# EAGLE schematic Amplifier+Mixer (EAGLE 9.3.0)
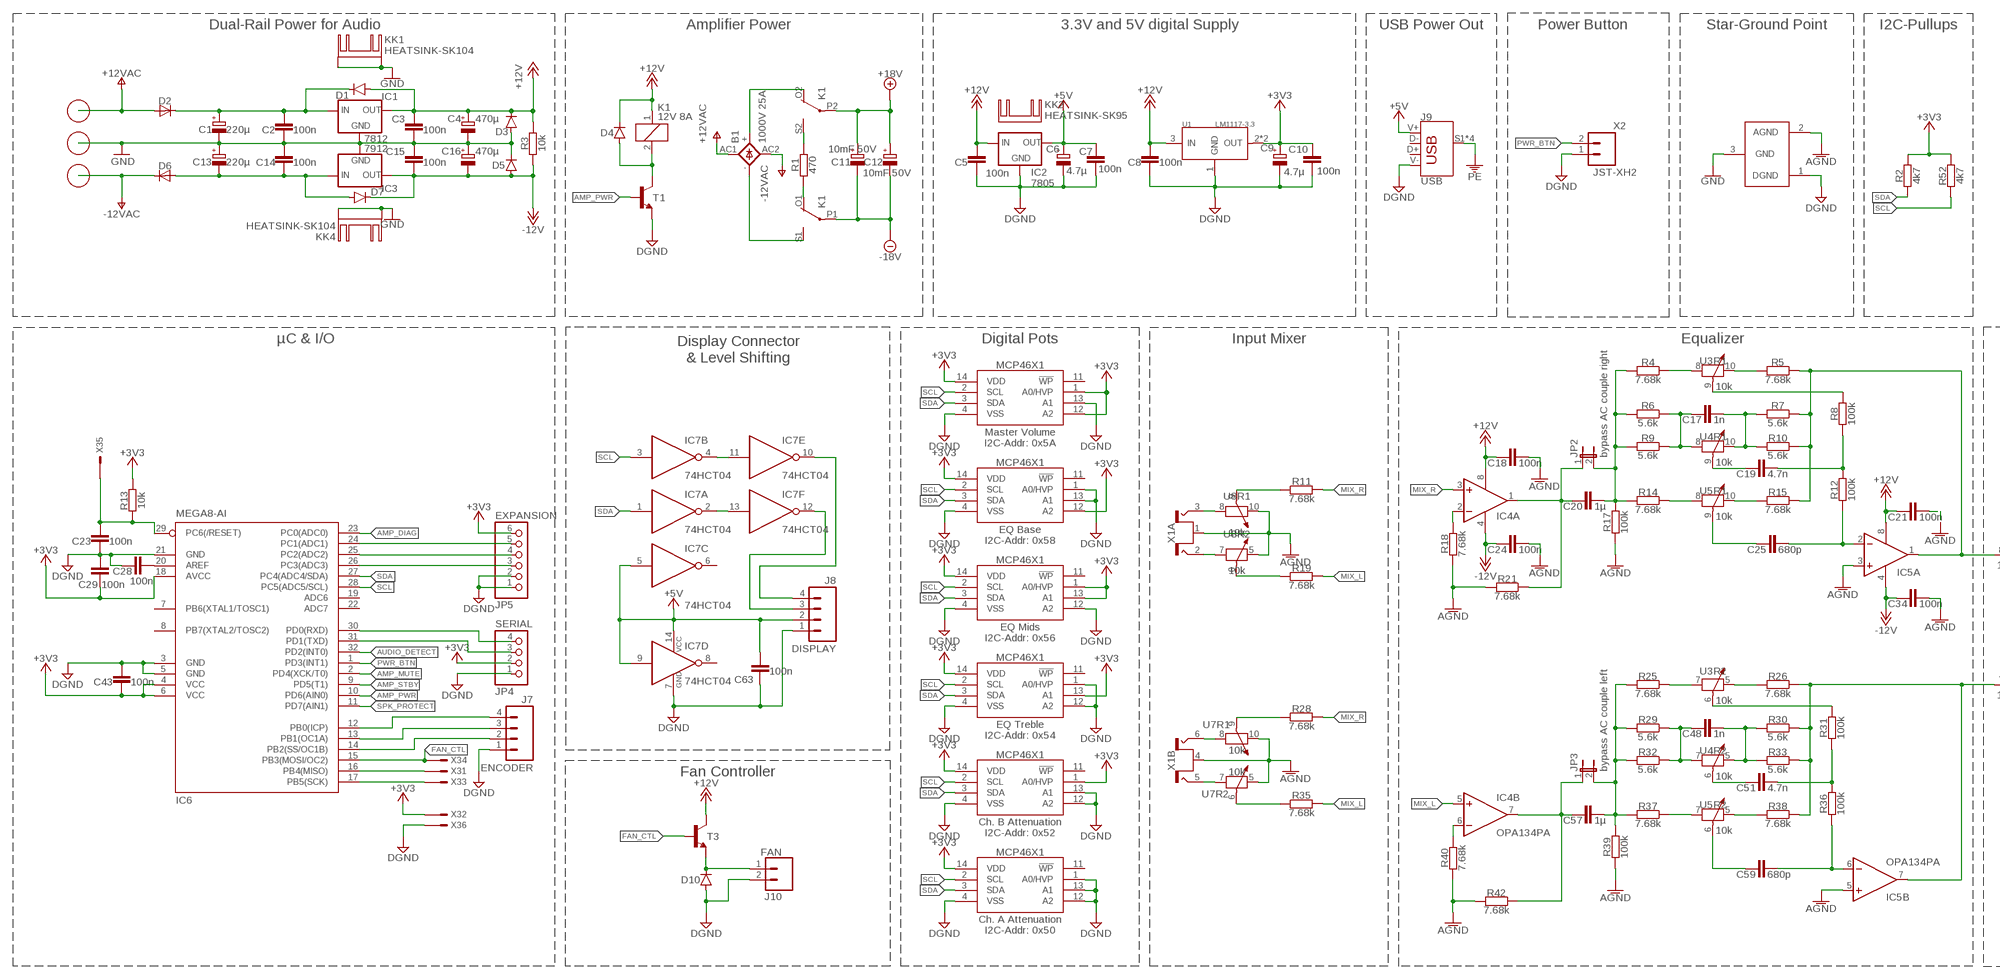
[diagram p0: schematic, sheet 1, part 1 of 2]
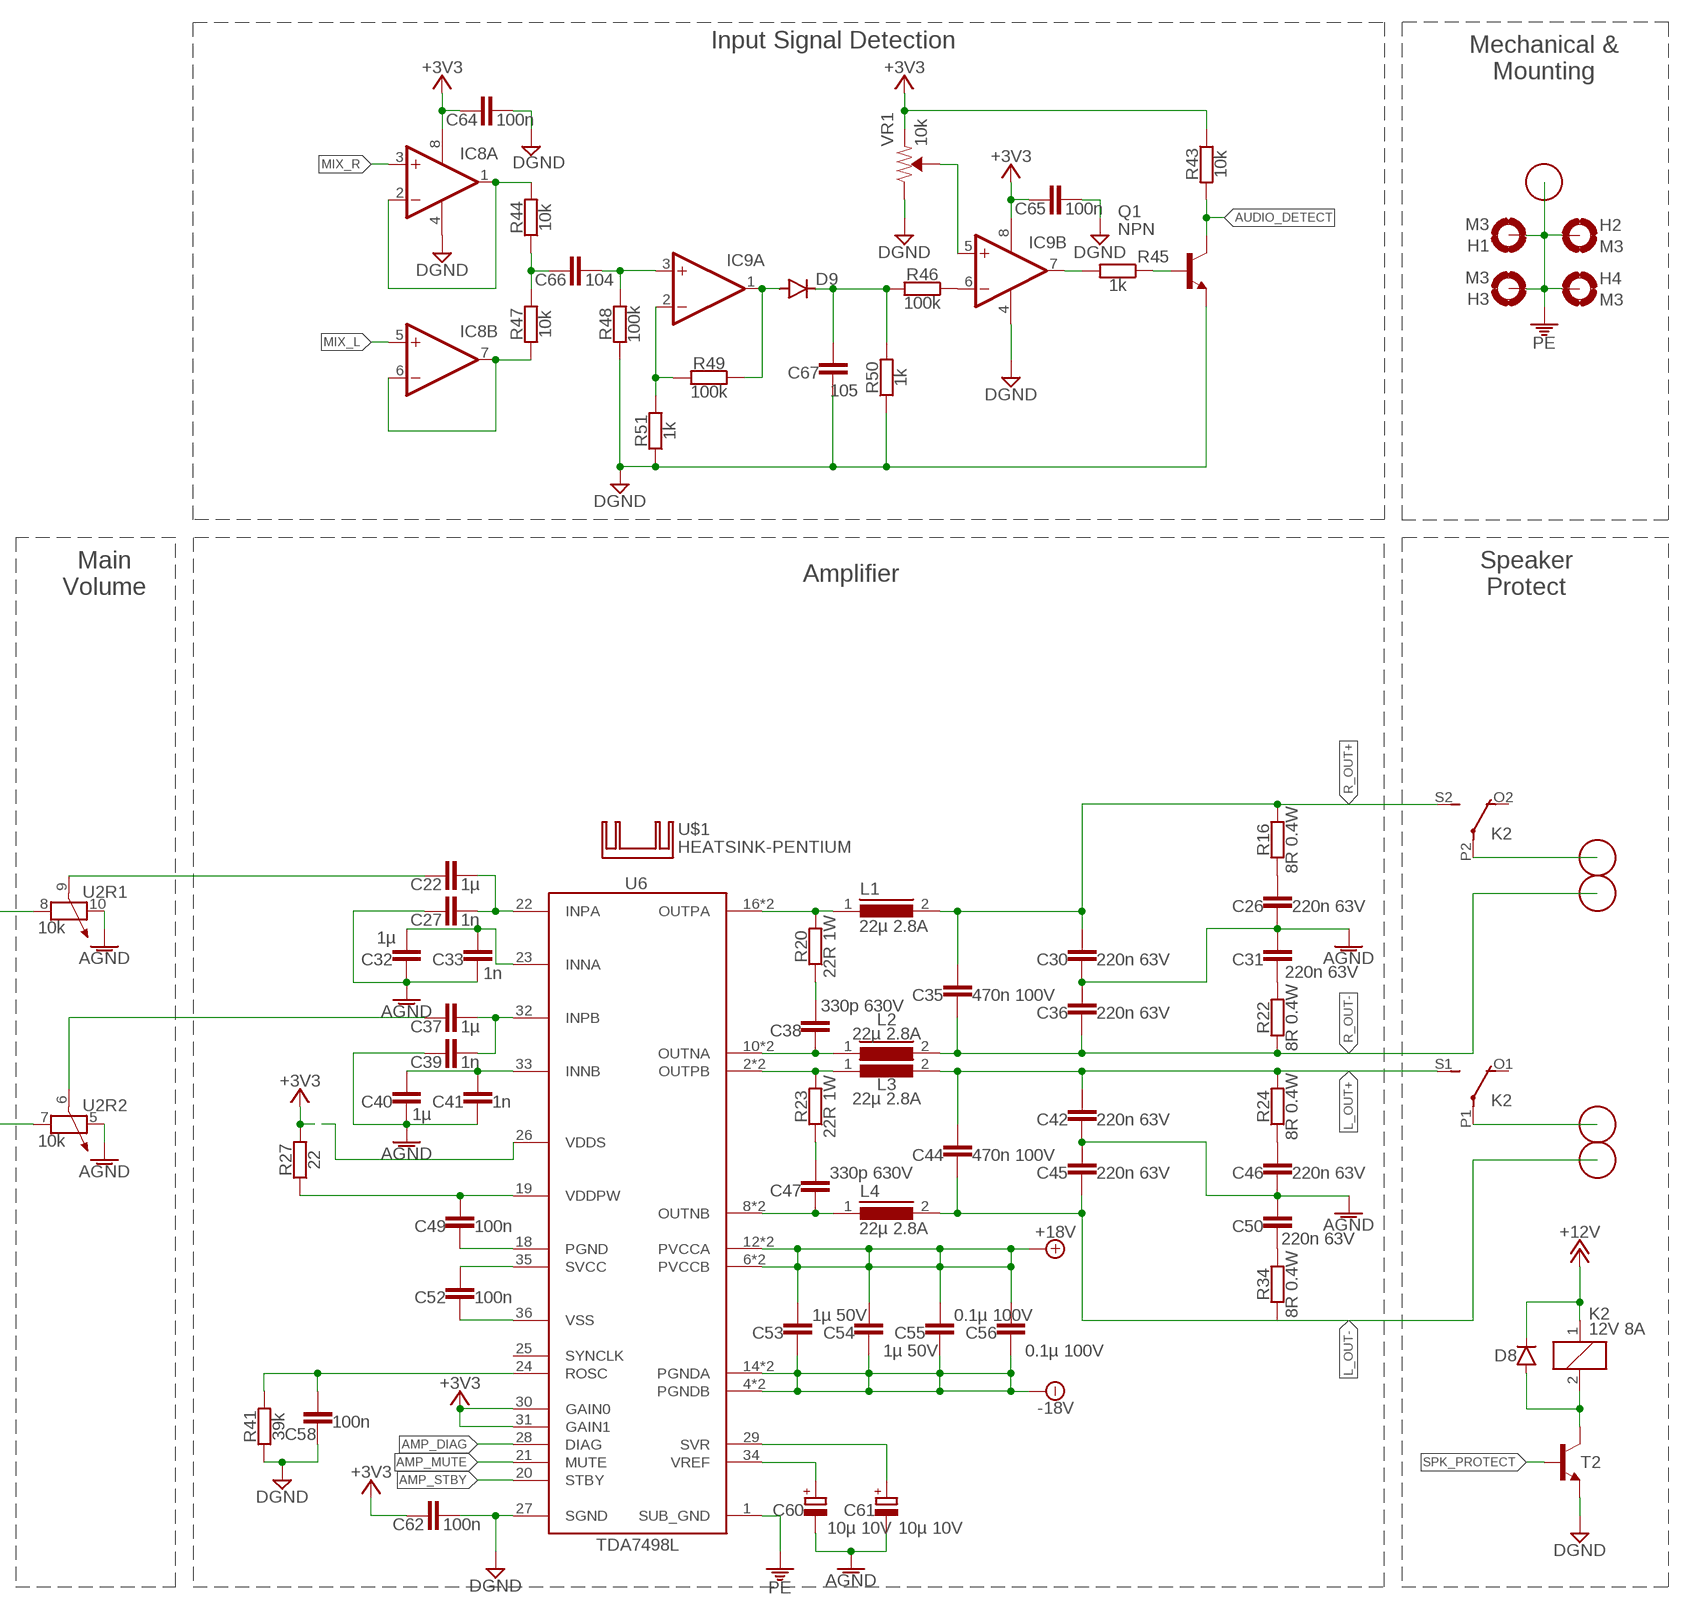
[diagram p1: schematic, sheet 1, part 2 of 2]

## Parts
B1  1000V 25A  RECTIFIER-FB100  [FB100]
C1  220µ  CPOL-EU175TMP-0810  [175TMP-0810]
C2  100n  C-EUC0603  [C0603]
C3  100n  C-EUC0603  [C0603]
C4  470µ  CPOL-EU175TMP-0810  [175TMP-0810]
C5  100n  C-EUC0603  [C0603]
C6  4.7µ  CPOL-EU153CLV-0505  [153CLV-0505]
C7  100n  C-EUC0603  [C0603]
C8  100n  C-EUC0603  [C0603]
C9  4.7µ  CPOL-EU153CLV-0505  [153CLV-0505]
C10  100n  C-EUC0603  [C0603]
C11  10mF 50V  TEAPO-SLG109M050S1A5T  [EB35D]
C12  10mF 50V  TEAPO-SLG109M050S1A5T  [EB35D]
C13  220µ  CPOL-EU175TMP-0810  [175TMP-0810]
C14  100n  C-EUC0603  [C0603]
C15  100n  C-EUC0603  [C0603]
C16  470µ  CPOL-EU175TMP-0810  [175TMP-0810]
C17  1n  C-EU050-025X075  [C050-025X075]
C18  100n  C-EUC0603  [C0603]
C19  4.7n  C-EU075-032X103  [C075-032X103]
C20  1µ  C-EU050-050X075  [C050-050X075]
C21  100n  C-EUC0603  [C0603]
C22  1µ  C-EU050-050X075  [C050-050X075]
C23  100n  C-EUC0603  [C0603]
C24  100n  C-EUC0603  [C0603]
C25  680p  C-EU050-045X075  [C050-045X075]
C26  220n 63V  C-EU050-025X075  [C050-025X075]
C27  1n  C-EU050-025X075  [C050-025X075]
C28  100n  C-EUC0603  [C0603]
C29  100n  C-EUC0603  [C0603]
C30  220n 63V  C-EU050-025X075  [C050-025X075]
C31  220n 63V  C-EU050-025X075  [C050-025X075]
C32  1µ  C-EU050-050X075  [C050-050X075]
C33  1n  C-EU050-025X075  [C050-025X075]
C34  100n  C-EUC0603  [C0603]
C35  470n 100V  C-EU050-045X075  [C050-045X075]
C36  220n 63V  C-EU050-025X075  [C050-025X075]
C37  1µ  C-EU050-050X075  [C050-050X075]
C38  330p 630V  C-EU050-045X075  [C050-045X075]
C39  1n  C-EU050-025X075  [C050-025X075]
C40  1µ  C-EU050-050X075  [C050-050X075]
C41  1n  C-EU050-025X075  [C050-025X075]
C42  220n 63V  C-EU050-025X075  [C050-025X075]
C43  100n  C-EUC0603  [C0603]
C44  470n 100V  C-EU050-045X075  [C050-045X075]
C45  220n 63V  C-EU050-025X075  [C050-025X075]
C46  220n 63V  C-EU050-025X075  [C050-025X075]
C47  330p 630V  C-EU050-045X075  [C050-045X075]
C48  1n  C-EU050-025X075  [C050-025X075]
C49  100n  C-EUC0603  [C0603]
C50  220n 63V  C-EU050-025X075  [C050-025X075]
C51  4.7n  C-EU075-032X103  [C075-032X103]
C52  100n  C-EUC0603  [C0603]
C53  1µ 50V  C-EUC1206K  [C1206K]
C54  1µ 50V  C-EUC1206K  [C1206K]
C55  0.1µ 100V  C-EUC1206K  [C1206K]
C56  0.1µ 100V  C-EUC1206K  [C1206K]
C57  1µ  C-EU050-050X075  [C050-050X075]
C58  100n  C-EUC0603  [C0603]
C59  680p  C-EU050-045X075  [C050-045X075]
C60  10µ 10V  CPOL-EU153CLV-0505  [153CLV-0505]
C61  10µ 10V  CPOL-EU153CLV-0505  [153CLV-0505]
C62  100n  C-EUC0603  [C0603]
C63  100n  C-EUC0603  [C0603]
C64  100n  C-EUC0603  [C0603]
C65  100n  C-EUC0603  [C0603]
C66  104  C-EUC0603  [C0603]
C67  105  C-EUC0603  [C0603]
D1  DIODEBAS16  [SOD-323]
D2  DIODE  [SODFL5024X231]
D3  DIODEBAS16  [SOD-323]
D4  DIODEBAS16  [SOD-323]
D5  DIODEBAS16  [SOD-323]
D6  DIODE  [SODFL5024X231]
D7  DIODEBAS16  [SOD-323]
D8  DIODEBAS16  [SOD-323]
D9  DIODE-SOD123  [SOD123]
D10  DIODEBAS16  [SOD-323]
H1  M3  HOLE-3MM-PAD  [3,0-PAD]
H2  M3  HOLE-3MM-PAD  [3,0-PAD]
H3  M3  HOLE-3MM-PAD  [3,0-PAD]
H4  M3  HOLE-3MM-PAD  [3,0-PAD]
IC1  7812  78XXS  [78XXS]
IC2  7805  78XXS  [78XXS]
IC3  7912  79XXS  [79XXS]
IC4  OPA134PA  LM358N  [DIL08]
IC5  OPA134PA  LM358N  [DIL08]
IC6  MEGA8-AI  [TQFP32-08]
IC7  74HCT04  7404D  [SO14]
IC8  2AMP_P8+4D  [SO08]
IC9  2AMP_P8+4D  [SO08]
J1  +12AC  TERMINAL-1  [TE-726386]
J2  0V  TERMINAL-1  [TE-726386]
J3  -12AC  TERMINAL-1  [TE-726386]
J4  PE  TERMINAL-1  [TE-726386]
J5  TERMINAL-BLOCK-2PLUG-IN  [MSTBV2]
J6  TERMINAL-BLOCK-2PLUG-IN  [MSTBV2]
J7  ENCODER  JST-XH4  [JST-4-PTH-VERT]
J8  DISPLAY  JST-XH4  [JST-4-PTH-VERT]
J9  USB  [ECON-USBBUVA]
J10  FAN  JST-XH2  [JST-2-PTH-VERT]
JP1  GND_CONNECT  [GND_CONNECT]
JP2  bypass AC couple right  JP1E  [JP1]
JP3  bypass AC couple left  JP1E  [JP1]
JP4  SERIAL  PINHD-1X4  [1X04]
JP5  EXPANSION  PINHD-1X6  [1X06]
K1  12V 8A  RELAY-F40.52  [F4052]
K2  12V 8A  RELAY-F40.52  [F4052]
KK1  HEATSINK-SK104  [SK104-PAD]
KK2  HEATSINK-SK95  [SK95-2M3]
KK4  HEATSINK-SK104  [SK104-PAD]
L1  22µ 2.8A  INDUCTOR12MM-SMD  [INDUCTOR-12MM]
L2  22µ 2.8A  INDUCTOR12MM-SMD  [INDUCTOR-12MM]
L3  22µ 2.8A  INDUCTOR12MM-SMD  [INDUCTOR-12MM]
L4  22µ 2.8A  INDUCTOR12MM-SMD  [INDUCTOR-12MM]
Q1  NPN  BC817-16LT1SMD  [SOT23-BEC]
R1  470  RESISTOR-0617-22  [0617/22]
R2  4k7  R-EU_R0603  [R0603]
R3  10k  R-EU_R1206  [R1206]
R4  7.68k  R-EU_MELF0207W  [MINI_MELF-0207W]
R5  7.68k  R-EU_MELF0207W  [MINI_MELF-0207W]
R6  5.6k  R-EU_MELF0207W  [MINI_MELF-0207W]
R7  5.6k  R-EU_MELF0207W  [MINI_MELF-0207W]
R8  100k  R-EU_MELF0204W  [MINI_MELF-0204W]
R9  5.6k  R-EU_MELF0207W  [MINI_MELF-0207W]
R10  5.6k  R-EU_MELF0207W  [MINI_MELF-0207W]
R11  7.68k  R-EU_MELF0207W  [MINI_MELF-0207W]
R12  100k  R-EU_MELF0204W  [MINI_MELF-0204W]
R13  10k  R-EU_R0603  [R0603]
R14  7.68k  R-EU_MELF0207W  [MINI_MELF-0207W]
R15  7.68k  R-EU_MELF0207W  [MINI_MELF-0207W]
R16  8R 0.4W  R-EU_MELF0204W  [MINI_MELF-0204W]
R17  100k  R-EU_MELF0204W  [MINI_MELF-0204W]
R18  7.68k  R-EU_MELF0207W  [MINI_MELF-0207W]
R19  7.68k  R-EU_MELF0207W  [MINI_MELF-0207W]
R20  22R 1W  R-EU_MELF0207W  [MINI_MELF-0207W]
R21  7.68k  R-EU_MELF0207W  [MINI_MELF-0207W]
R22  8R 0.4W  R-EU_MELF0204W  [MINI_MELF-0204W]
R23  22R 1W  R-EU_MELF0207W  [MINI_MELF-0207W]
R24  8R 0.4W  R-EU_MELF0204W  [MINI_MELF-0204W]
R25  7.68k  R-EU_MELF0207W  [MINI_MELF-0207W]
R26  7.68k  R-EU_MELF0207W  [MINI_MELF-0207W]
R27  22  R-EU_R0603  [R0603]
R28  7.68k  R-EU_MELF0207W  [MINI_MELF-0207W]
R29  5.6k  R-EU_MELF0207W  [MINI_MELF-0207W]
R30  5.6k  R-EU_MELF0207W  [MINI_MELF-0207W]
R31  100k  R-EU_MELF0204W  [MINI_MELF-0204W]
R32  5.6k  R-EU_MELF0207W  [MINI_MELF-0207W]
R33  5.6k  R-EU_MELF0207W  [MINI_MELF-0207W]
R34  8R 0.4W  R-EU_MELF0204W  [MINI_MELF-0204W]
R35  7.68k  R-EU_MELF0207W  [MINI_MELF-0207W]
R36  100k  R-EU_MELF0204W  [MINI_MELF-0204W]
R37  7.68k  R-EU_MELF0207W  [MINI_MELF-0207W]
R38  7.68k  R-EU_MELF0207W  [MINI_MELF-0207W]
R39  100k  R-EU_MELF0204W  [MINI_MELF-0204W]
R40  7.68k  R-EU_MELF0207W  [MINI_MELF-0207W]
R41  39k  R-EU_R0603  [R0603]
R42  7.68k  R-EU_MELF0207W  [MINI_MELF-0207W]
R43  10k  R-EU_R0603  [R0603]
R44  10k  R-EU_R0603  [R0603]
R45  1k  R-EU_R0603  [R0603]
R46  100k  R-EU_R0603  [R0603]
R47  10k  R-EU_R0603  [R0603]
R48  100k  R-EU_R0603  [R0603]
R49  100k  R-EU_R0603  [R0603]
R50  1k  R-EU_R0603  [R0603]
R51  1k  R-EU_R0603  [R0603]
R52  4k7  R-EU_R0603  [R0603]
T1  BC817-16-NPN-SOT23-BEC  [SOT23-BEC]
T2  BC817-16-NPN-SOT23-BEC  [SOT23-BEC]
T3  BC817-16-NPN-SOT23-BEC  [SOT23-BEC]
U1  LM1117-3.3  PMIC-CJT1117-3.3(SOT223)  [SOT-223]
U2  10k  MCP46X1  [SOP65P640X120-14]
U3  10k  MCP46X1  [SOP65P640X120-14]
U4  10k  MCP46X1  [SOP65P640X120-14]
U5  10k  MCP46X1  [SOP65P640X120-14]
U6  TDA7498L  [SOP50P1010X245-36]
U7  10k  MCP46X1  [SOP65P640X120-14]
U8  10k  MCP46X1  [SOP65P640X120-14]
U$1  HEATSINK-PENTIUM  [HEATSINK-PENTIUM]
VR1  10k  TRIMPOT-SMD-3MM-OPEN-1/10W-25%  [TRIMPOT-SMD-TC33X]
X1  RCA-4-CHANNEL  [BKL-072385]
X2  JST-XH2  [JST-2-PTH-VERT]
X3  ICSP  CONN-IDC-6  [057-006-1]

## Nets
+3V3: C9.+ C10.1 C29.1 C43.1 C62.2 C64.1 C65.1 IC6.4(VCC) IC6.6(VCC) IC6.18(AVCC) IC8.8(P:V+) IC9.8(P:V+) JP4.2 JP5.6 R2.2 R13.2 R27.2 R43.1 R52.2 U1.2(OUT) U1.TER(OUT) U2.1(A0/HVP) U2.12(A2) U2.14(VDD) U3.12(A2) U3.14(VDD) U4.1(A0/HVP) U4.13(A1) U4.14(VDD) U5.13(A1) U5.14(VDD) U6.26(VDDS) U6.30(GAIN0) U6.31(GAIN1) U7.1(A0/HVP) U7.14(VDD) U8.14(VDD) VR1.3(CCW) X3.2
+5V: C6.+ C7.1 C63.2 IC2.OUT IC7.5(C:I) IC7.9(D:I) IC7.14(P:VCC) J8.2 J9.V+(VBUS)
+12V: C3.1 C4.+ C5.1 C8.1 C18.1 C21.1 D1.A D3.C D4.C D8.C IC1.OUT IC2.IN IC4.8(P:V+) IC5.8(P:V+) K1.1 K2.1 R3.1 T3.C U1.3(IN)
+18V: C11.+ C12.+ C53.1 C54.1 C55.1 C56.1 K1.P2(SW2:P) U6.6(PVCCB) U6.7(PVCCB) U6.12(PVCCA) U6.13(PVCCA)
-12V: C15.2 C16.- C24.1 C34.1 D5.A D7.C IC3.OUT IC4.4(P:V-) IC5.4(P:V-) R3.2
-18V: C11.- C12.- C53.2 C54.2 C55.2 C56.2 K1.P1(SW1:P) U6.4(PGNDB) U6.5(PGNDB) U6.14(PGNDA) U6.15(PGNDA)
AGND: C18.2 C21.2 C24.2 C26.2 C27.1 C30.2 C31.1 C32.1 C33.1 C34.2 C36.1 C39.1 C40.1 C41.1 C42.2 C45.1 C46.2 C50.1 C60.- C61.- IC5.3(A:+IN) IC5.5(B:+IN) JP1.2(AGND) R17.1 R18.2 R21.2 R39.1 R40.2 R42.2 U2.5(R2:B) U2.10(R1:B) U7.5(R2:B) U7.10(R1:B) U8.5(R2:B) U8.10(R1:B) X1.1(A:S) X1.4(B:S)
AMP_DIAG: IC6.23(PC0(ADC0)) U6.28(DIAG)
AMP_MUTE: IC6.2(PD4(XCK/T0)) U6.21(MUTE)
AMP_PWR: IC6.10(PD6(AIN0)) T1.B
AMP_STBY: IC6.9(PD5(T1)) U6.20(STBY)
AUDIO_DETECT: IC6.32(PD2(INT0)) Q1.C R43.2
DGND: C5.2 C6.- C7.2 C8.2 C9.- C10.2 C23.1 C28.2 C29.2 C43.2 C58.2 C62.1 C63.1 C64.2 C65.2 C67.1 D10.A IC2.GND IC6.3(GND) IC6.5(GND) IC6.21(GND) IC7.7(P:GND) IC8.4(P:V-) IC9.4(P:V-) J7.1 J8.1 J9.V-(GND) J10.2 JP1.1(DGND) JP4.1 JP5.1 JP5.2 Q1.E R41.1 R48.1 R50.1 R51.1 T1.E T2.E U1.1(GND) U2.4(VSS) U2.13(A1) U3.1(A0/HVP) U3.4(VSS) U3.13(A1) U4.4(VSS) U4.12(A2) U5.1(A0/HVP) U5.4(VSS) U5.12(A2) U6.27(SGND) U7.4(VSS) U7.12(A2) U7.13(A1) U8.1(A0/HVP) U8.4(VSS) U8.12(A2) U8.13(A1) VR1.1(CW) X2.1 X3.6
EQ_OUT_L: IC5.7(B:OUT) R26.1 R30.1 R33.1 R38.1 U2.7(R2:A)
EQ_OUT_R: IC5.1(A:OUT) R5.1 R7.1 R10.1 R15.1 U2.8(R1:A)
FAN_CTL: IC6.15(PB3(MOSI/OC2)) T3.B X3.4
GND: C1.- C2.2 C3.2 C4.- C13.+ C14.1 C15.1 C16.+ D3.A D5.C IC1.GND IC3.GND J2.P$1 J2.P$2 JP1.3(GND) KK1.K1(K) KK1.K2(K) KK4.K1(K) KK4.K2(K)
L_OUT+: C42.1 C44.1 K2.S1(SW1:S) L3.2 R24.2
L_OUT-: C44.2 C45.2 J6.2 L4.2 R34.1
MIX_AMP_L: C57.1 IC4.7(B:OUT) JP3.1 R42.1
MIX_AMP_R: C20.1 IC4.1(A:OUT) JP2.1 R21.1
MIX_L: IC4.5(B:+IN) IC8.5(B:+IN) R19.2 R35.2
MIX_R: IC4.3(A:+IN) IC8.3(A:+IN) R11.2 R28.2
N$1: C20.2 JP2.2 R4.2 R6.2 R9.2 R14.2 R17.2
N$2: R14.1 U5.8(R1:A)
N$3: C25.2 U5.9(R1:W)
N$4: R15.2 U5.10(R1:B)
N$5: C17.1 R6.1 R9.1 U4.8(R1:A)
N$6: C57.2 JP3.2 R25.2 R29.2 R32.2 R37.2 R39.2
N$7: R8.2 U3.9(R1:W)
N$8: R31.2 U3.6(R2:W)
N$9: B1.+ K1.O2(SW2:O)
N$10: R26.2 U3.5(R2:B)
N$11: C19.2 U4.9(R1:W)
N$12: C19.1 R8.1 R12.2
N$13: C66.1 R44.1 R47.2
N$14: R25.1 U3.7(R2:A)
N$15: C17.2 R7.2 R10.2 U4.10(R1:B)
N$16: C59.2 U5.6(R2:W)
N$17: C51.2 U4.6(R2:W)
N$18: R4.1 U3.8(R1:A)
N$19: C48.1 R29.1 R32.1 U4.7(R2:A)
N$20: C48.2 R30.2 R33.2 U4.5(R2:B)
N$21: R37.1 U5.7(R2:A)
N$22: R38.2 U5.5(R2:B)
N$23: C13.- C14.2 D6.A D7.A IC3.IN
N$24: C1.+ C2.1 D1.C D2.C IC1.IN
N$25: C66.2 IC9.3(A:+IN) R48.2
N$26: C52.2 U6.36(VSS)
N$27: B1.- K1.S1(SW1:S)
N$28: R5.2 U3.10(R1:B)
N$29: C51.1 R31.1 R36.2
N$30: C52.1 U6.35(SVCC)
N$31: IC9.2(A:-IN) R49.2 R51.2
N$32: D9.A IC9.1(A:OUT) R49.1
N$33: C67.2 D9.C R46.2 R50.2
N$34: IC9.6(B:-IN) R46.1
N$35: IC9.5(B:+IN) VR1.2(WIPER)
N$36: IC9.7(B:OUT) R45.2
N$37: Q1.B R45.1
N$38: IC8.6(B:-IN) IC8.7(B:OUT) R47.1
N$39: IC8.1(A:OUT) IC8.2(A:-IN) R44.2
N$40: R11.1 U8.9(R1:W)
N$41: R19.1 U8.6(R2:W)
N$42: R35.1 U7.6(R2:W)
N$43: R28.1 U7.9(R1:W)
N$44: IC4.6(B:-IN) R40.1
N$45: IC6.14(PB2(SS/OC1B)) J7.2
N$46: U7.8(R1:A) X1.6(B:T2)
N$47: U8.8(R1:A) X1.3(A:T2)
N$48: U8.7(R2:A) X1.2(A:T1)
N$49: U7.7(R2:A) X1.5(B:T1)
N$50: D4.A K1.2 T1.C
N$51: J6.1 K2.P1(SW1:P)
N$52: IC4.2(A:-IN) R18.1
N$53: K1.S2(SW2:S) R1.1
N$54: C58.1 R41.2 U6.24(ROSC)
N$55: C49.1 R27.1 U6.19(VDDPW)
N$56: C49.2 U6.18(PGND)
N$57: C40.2 C41.2 U6.33(INNB)
N$58: C37.2 C39.2 U6.32(INPB)
N$59: C32.2 C33.2 U6.23(INNA)
N$60: C22.2 C27.2 U6.22(INPA)
N$61: J5.1 K2.P2(SW2:P)
N$62: C50.2 R34.2
N$63: D10.C J10.1 T3.E
N$64: C46.1 R24.1
N$65: C60.+ U6.34(VREF)
N$66: C61.+ U6.29(SVR)
N$67: C31.2 R22.2
N$68: C26.1 R16.1
N$69: C47.2 L4.1 U6.8(OUTNB) U6.9(OUTNB)
N$70: C38.2 L2.1 U6.10(OUTNA) U6.11(OUTNA)
N$71: C38.1 R20.1
N$72: C47.1 R23.1
N$73: L1.1 R20.2 U6.16(OUTPA) U6.17(OUTPA)
N$74: L3.1 R23.2 U6.2(OUTPB) U6.3(OUTPB)
N$75: D8.A K2.2 T2.C
N$76: IC6.13(PB1(OC1A)) J7.3
N$77: C28.1 IC6.20(AREF)
N$78: IC6.12(PB0(ICP)) J7.4
N$79: IC6.16(PB4(MISO)) X3.1
N$80: IC6.17(PB5(SCK)) X3.3
N$82: C23.2 IC6.29(PC6(/RESET)) R13.1 X3.5
N$83: IC7.2(A:O) IC7.13(F:I)
N$84: IC7.4(B:O) IC7.11(E:I)
N$85: IC6.30(PD0(RXD)) JP4.4
N$86: IC6.31(PD1(TXD)) JP4.3
N$88: IC6.24(PC1(ADC1)) JP5.5
N$89: IC6.25(PC2(ADC2)) JP5.4
N$90: IC6.26(PC3(ADC3)) JP5.3
N$91: K1.O1(SW1:O) R1.2
OUT_L_DAMPED: C59.1 IC5.6(B:-IN) R36.1
OUT_R_DAMPED: C25.1 IC5.2(A:-IN) R12.1
PE: H1.B3,0(MOUNT) H2.B3,0(MOUNT) H3.B3,0(MOUNT) H4.B3,0(MOUNT) J4.P$1 J4.P$2 J9.S1(SHIELD) J9.S2(SHIELD) J9.S3(SHIELD) J9.S4(SHIELD) U6.1(SUB_GND)
PREAMP_OUT_L: C37.1 U2.6(R2:W)
PREAMP_OUT_R: C22.1 U2.9(R1:W)
PWR_BTN: IC6.1(PD3(INT1)) X2.2
R_OUT+: C30.1 C35.1 K2.S2(SW2:S) L1.2 R16.2
R_OUT-: C35.2 C36.2 J5.2 L2.2 R22.1
SCL: IC6.28(PC5(ADC5/SCL)) IC7.3(B:I) R52.1 U2.2(SCL) U3.2(SCL) U4.2(SCL) U5.2(SCL) U7.2(SCL) U8.2(SCL)
SCL_5V: IC7.10(E:O) J8.4
SDA: IC6.27(PC4(ADC4/SDA)) IC7.1(A:I) R2.1 U2.3(SDA) U3.3(SDA) U4.3(SDA) U5.3(SDA) U7.3(SDA) U8.3(SDA)
SDA_5V: IC7.12(F:O) J8.3
SPK_PROTECT: IC6.11(PD7(AIN1)) T2.B
V+: B1.AC1 D2.A J1.P$1 J1.P$2 ; supply symbol labelled +12VAC
V-: B1.AC2 D6.C J3.P$1 J3.P$2 ; supply symbol labelled -12VAC
Unconnected: IC6.7(PB6(XTAL1/TOSC1)) IC6.8(PB7(XTAL2/TOSC2)) IC6.19(ADC6) IC6.22(ADC7) IC7.6(C:O) IC7.8(D:O) J9.D+ J9.D- K2.O1(SW1:O) K2.O2(SW2:O) U2.11(!WP) U3.11(!WP) U4.11(!WP) U5.11(!WP) U6.25(SYNCLK) U7.11(!WP) U8.11(!WP)

## Notes on the sheet
- Dual-Rail Power for Audio | Amplifier Power | 3.3V and 5V digital Supply | USB Power Out | Power Button | Star-Ground Point | I2C-Pullups | Input Signal Detection
- Mechanical &
  Mounting
- µC & I/O | Digital Pots | Input Mixer | Equalizer
- Display Connector
  & Level Shifting
- Main
  Volume
- Amplifier
- Speaker
  Protect
- Master Volume
- I2C-Addr: 0x5A
- EQ Base
- I2C-Addr: 0x58
- EQ Mids
- I2C-Addr: 0x56
- EQ Treble
- I2C-Addr: 0x54
- Fan Controller
- Ch. B Attenuation
- I2C-Addr: 0x52
- Ch. A Attenuation
- I2C-Addr: 0x50

## Library data of the parts
B1 = Class D Amp:RECTIFIER-FB100; CONRAD: 1582009 - 62; SPEC: TC-GBI25M
C1 C4 C6 C9 C13 C16 C60 C61 = rcl:CPOL-EU: POLARIZED CAPACITOR, European symbol; SPICEPREFIX: C
C2 C3 C5 C7 C8 C10 C14 C15 C18 C21 C23 C24 C28 C29 C34 C43 C49 C52 C58 C62-C67 = rcl:C-EU: CAPACITOR, European symbol; SPICEPREFIX: C
C11 C12 = Class D Amp:TEAPO-SLG109M050S1A5T; CONRAD: 1325816 - 62; SPEC: Teapo SLG109M050S1A5T40K
C17 C27 C33 C39 C41 C48 = rcl:C-EU: CAPACITOR, European symbol; CONRAD: 1235242 - 62; SPEC: Kemet R82EC1100AA50K+; SPICEPREFIX: C
C19 C51 = rcl:C-EU: CAPACITOR, European symbol; CONRAD: 459871 - 62; SPEC: Wima FKS3D014702B00KSSD; SPICEPREFIX: C
C20 C22 C32 C37 C40 C57 = rcl:C-EU: CAPACITOR, European symbol; CONRAD: 1235274 - 62; SPEC: Kemet R82DC4100AA60K+; SPICEPREFIX: C
C25 C59 = rcl:C-EU: CAPACITOR, European symbol; CONRAD: 450548 - 62; SPEC: Wima FKP2J006801D00HSSD; SPICEPREFIX: C
C26 C30 C31 C36 C42 C45 C46 C50 = rcl:C-EU: CAPACITOR, European symbol; CONRAD: 1235241 - 62; SPEC: Kemet R82DC3220AA60K+; SPICEPREFIX: C
C35 C44 = rcl:C-EU: CAPACITOR, European symbol; CONRAD: 459945 - 62; SPEC: Wima MKS2D034701E00KSSD; SPICEPREFIX: C
C38 C47 = rcl:C-EU: CAPACITOR, European symbol; CONRAD: 450521 - 62; SPEC: Wima FKP2J003301D00HSSD; SPICEPREFIX: C
C53 C54 = rcl:C-EU: CAPACITOR, European symbol; CONRAD: 458140 - 62; SPICEPREFIX: Kemet C1206C105K5RAC7800+
C55 C56 = rcl:C-EU: CAPACITOR, European symbol; CONRAD: 458125 - 62; SPICEPREFIX: Kemet C1206C104K1RAC7800+
D1 D3-D5 D7 D8 D10 = SparkFun-DiscreteSemi:DIODE: Diode These are standard reverse protection diodes and small signal diodes. SMA package can handle up to about 1A. SOD-323 can handle about 200mA. What the SOD-323 package when ordering, there are some mfgs out there that are 5-pin packages.; PROD_ID: DIO-09646; VALUE: 250mA/100V
D2 D6 = Parts:DIODE
D9 = diode:DIODE-: DIODE
H1-H4 = Class D Amp:HOLE-3MM-PAD
IC1 IC2 = v-reg:78XXS: VOLTAGE REGULATOR
IC3 = v-reg:79XXS: VOLTAGE REGULATOR
IC4 IC5 = linear:LM358: OP AMP also LM158; LM258; LM2904 Source: http://cache.national.com/ds/LM/LM158.pdf; CONRAD: 1011117 - 62
IC6 = atmel:MEGA8: MICROCONTROLLER 8 Kbytes FLASH, 1 kbytes SRAM, 512 bytes EEPROM, USART, 6-channel 10 bit ADC, 2-channel 8 bit ADC Pin compatible with Atmega48, ATMega88, ATMega168 Source: avr.lbr; MPN: ATMEGA8-16AU; OC_FARNELL: 9171371; OC_NEWARK: 73M8863
IC7 = 74xx-eu:74*04: Hex INVERTER
IC8 IC9 = linear:2AMP_P8+4: OP AMP
J1-J4 = AdapterBoard:TERMINAL-1
J5 J6 = AdapterBoard:TERMINAL-BLOCK-2
J7 J8 = Class D Amp:JST-XH4
J9 = AdapterBoard:USB
J10 X2 = Class D Amp:JST-XH2
JP1 = Class D Amp:GND_CONNECT: Use to make a connection of multiple grounds in only one place.
JP2 JP3 = jumper:JP1E: JUMPER
JP4 = pinhead:PINHD-1X4: PIN HEADER
JP5 = pinhead:PINHD-1X6: PIN HEADER
K1 K2 = Class D Amp:RELAY-F40.52; CONRAD: 629528 - 62; SPEC: Hongfa HF115F/012-2ZS4A
KK1 KK4 = Class D Amp:HEATSINK-SK104
KK2 = Class D Amp:HEATSINK-SK95
L1-L4 = Class D Amp:INDUCTOR; CONRAD: 1589286 - 62; SPEC: TRU COMPONENTS TC-PIS4720-220M203
Q1 = transistor-npn:BC817*: NPN Transistor
R1 = Class D Amp:RESISTOR-0617-22; CONRAD: 402095 - 62; SPEC: Hochlast-Widerstand 470 Ω axial bedrahtet 5 W 5 % 1 St.
R2 R3 R13 R27 R41 R43-R52 = rcl:R-EU_: RESISTOR, European symbol; SPICEPREFIX: R
R4 R5 R11 R14 R15 R18 R19 R21 R25 R26 R28 R35 R37 R38 R40 R42 = rcl:R-EU_: RESISTOR, European symbol; CONRAD: 1621954 - 62; SPEC: Viking Tech CSRV0207FTDT7681; SPICEPREFIX: R
R6 R7 R9 R10 R29 R30 R32 R33 = rcl:R-EU_: RESISTOR, European symbol; CONRAD: 1621942 - AN; SPEC: Viking Tech CSRV0207FTDT5601; SPICEPREFIX: R
R8 R12 R17 R31 R36 R39 = rcl:R-EU_: RESISTOR, European symbol; CONRAD: 1621537 - 62; SPEC: Viking Tech CSRV0204FTDG1003; SPICEPREFIX: R
R16 R22 R24 R34 = rcl:R-EU_: RESISTOR, European symbol; CONRAD: 1621223 - 62; SPEC: Viking Tech CSRV0204FTDG7R68; SPICEPREFIX: R
R20 R23 = rcl:R-EU_: RESISTOR, European symbol; CONRAD: 1621763 - 62; SPEC: Viking Tech CSRV0207FTDT0220; SPICEPREFIX: R
T1-T3 = transistor:*-NPN-: NPN Transistror BF959 corrected 2008.03.06; CONRAD: 1112873 - 62
U1 = NixieClock:PMIC-CJT1117-3.3(SOT223): 310030097; MPN: CJT1117-3.3; VALUE: CJT1117-3.3-SOT223
U2-U5 U7 U8 = Class D Amp:MCP46X1
U6 = Class D Amp:TDA7498L; CONRAD: 1184453 - 62
U$1 = Class D Amp:HEATSINK-PENTIUM
VR1 = SparkFun-Resistors:TRIMPOT: Trimming Potentiometer (Trimpot) Three-terminal potentiometers, with an adjustable wiper and two adjustable resistors. A pot can be used to create a configurable voltage divider, or as a variable resistor. "Trimpots" are a subset of potentiometers, usually intended for "set-and-forget" applications. They're often more delicate than standard potentiometers - rated for fewer turns. Variants PTH-KNOB - PTH Trimpot w/ finger-adjustable knob Trimpot 10K with Knob <https://www.sparkfun.com/products/9806> (COM-09806) Datasheet <http://www.sparkfun.com/datasheets/Components/General/TSR-3386.pdf> SMD-3MM-CLOSED-FRAME - SMD 3mm Square Closed-Frame Trimpot Used on e.g. EasyDriver - Stepper Motor Driver <https://www.sparkfun.com/products/12779> Datasheet <http://www.bitechnologies.com/pdfs/22.pdf> (22AR10KTR) SMD-5MM - SMD 5mm Square Closed-Frame Trimpot Used on e.g. IOIO-OTG - V2.2 <https://www.sparkfun.com/products/13613> Datasheet <http://www.vishay.com/docs/51008/ts53.pdf> (TS53YL502MR10) SMD-3MM-1/10W-25% - 3mm Square Open-Frame Trimpot Used on e.g. SparkFun Shapeoko <https://www.sparkfun.com/products/13899> Datasheet <http://www.bourns.com/docs/Product-Datasheets/TC33.pdf> (TC33X-2-103E); PROD_ID: RES-12428
X1 = Class D Amp:RCA-4-CHANNEL
X3 = Class D Amp:CONN-IDC-6